# Altium schematic sheet LIDO-HW.002.BlockDiagram.SchDoc
size A3; CompanyName: EST-Floattech; DrawnBy: RR; Organization: EST-Floattech; Address2: Zandsteen 1; Address3: 2132 MZ; Address4: Hoofddorp; DocumentNumber: 21xxx; Revision: 1.0; SheetNumber: 2; SheetTotal: 18
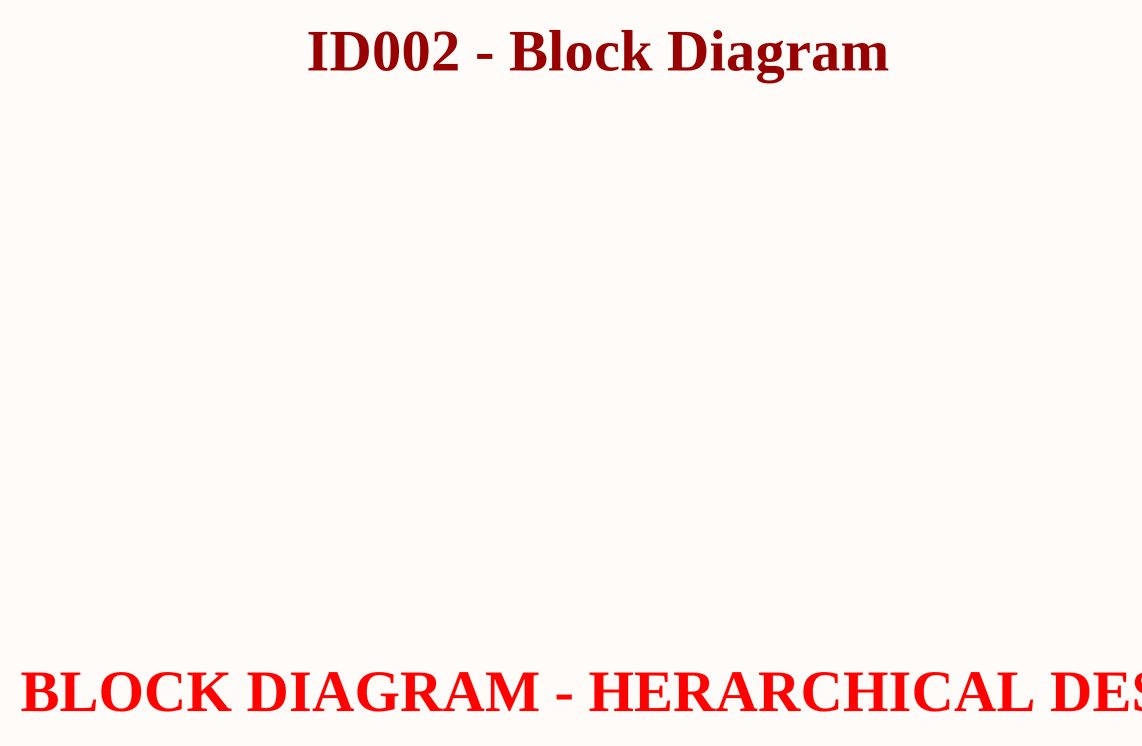
[diagram p0: LIDO-HW.002.BlockDiagram.SchDoc]

## Notes on the sheet
- ID002 - Block Diagram
- BLOCK DIAGRAM - HERARCHICAL DESIGN
- Title:
- Size:
- Date:
- A3
- Sheet       of
- Engineer:
- Version:
- Part Number:
- Revision:
- Rev. date:
- Project:
- File: